# Altium schematic sheet RXTX4F1.SchDoc
size A
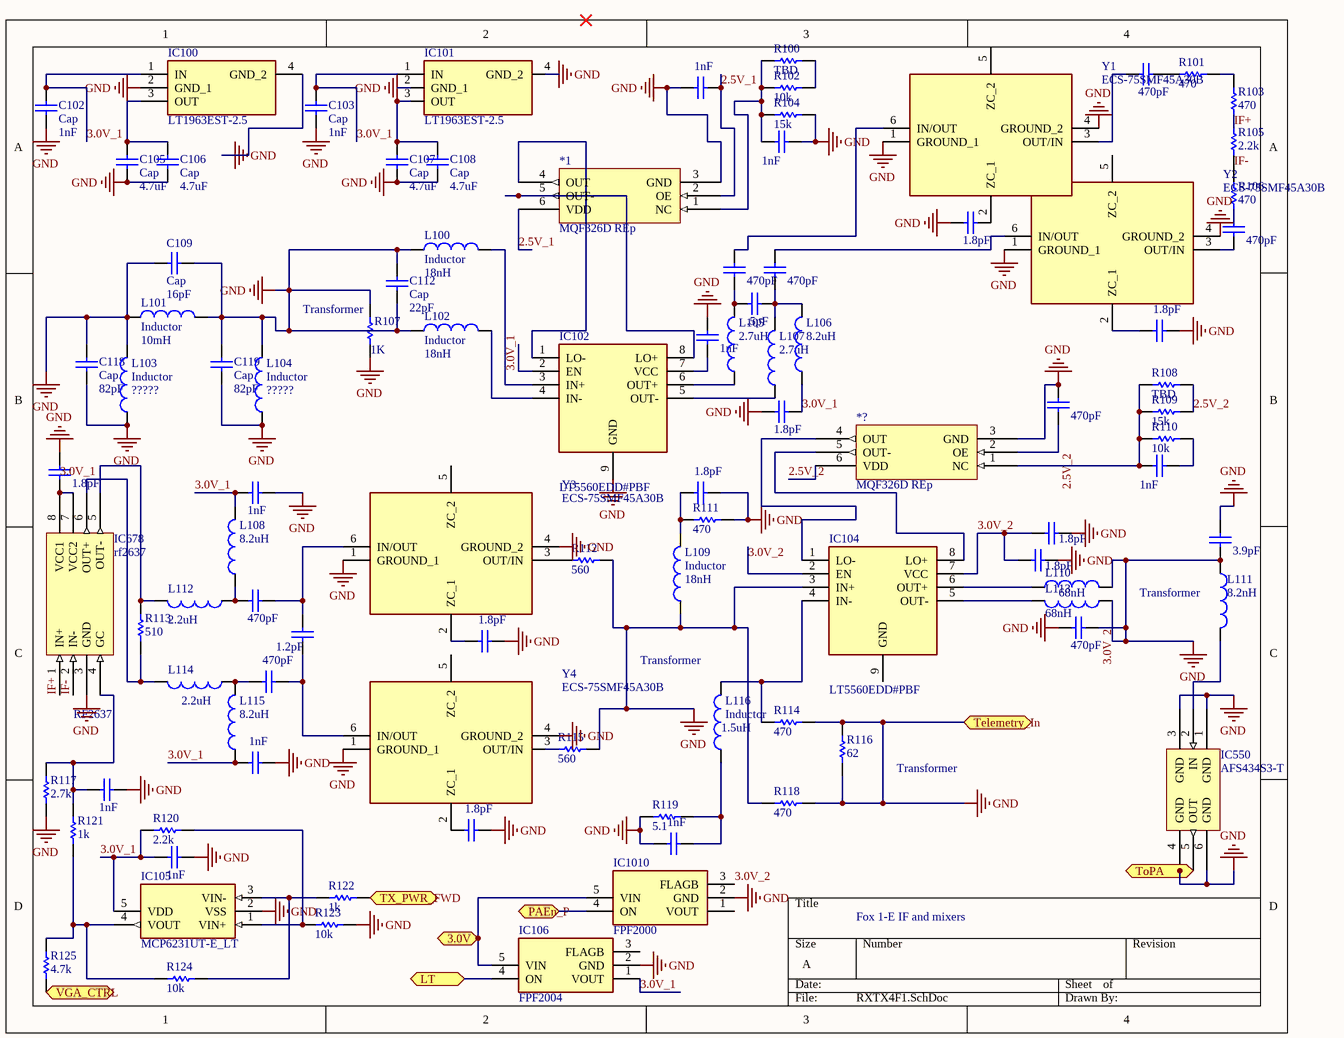
[diagram p0: RXTX4F1.SchDoc]

## Parts
*1  MQF326D REp  [MQF326D]
*?  MQF326D REp  [MQF326D]
C100  value 470pF  [0603]  (hidden comment: Cap)
C101  value 1nF  [0603]  (hidden comment: Cap)
C102  Cap  value 1nF  [0603]
C103  Cap  value 1nF  [0603]
C104  value 1nF  [0603]  (hidden comment: Cap)
C105  Cap  value 4.7uF  [0603]
C106  Cap  value 4.7uF  [0603]
C107  Cap  value 4.7uF  [0603]
C108  Cap  value 4.7uF  [0603]
C109  Cap  value 16pF  [0603]
C110  value 1.8pF  [0603]  (hidden comment: Cap)
C111  value 470pF  [0603]  (hidden comment: Cap)
C112  Cap  value 22pF  [0603]
C113  value 470pF  [0603]  (hidden comment: Cap)
C114  value 470pF  [0603]  (hidden comment: Cap)
C115  value 470pF  [0603]  (hidden comment: Cap)
C116  value .5pF  [0603]  (hidden comment: Cap)
C117  value 1.8pF  [0603]  (hidden comment: Cap)
C118  Cap  value 82pF  [0603]
C119  Cap  value 82pF  [0603]
C120  value 1nF  [0603]  (hidden comment: Cap)
C121  value 1nF  [0603]  (hidden comment: Cap)
C122  value 1.8pF  [0603]  (hidden comment: Cap)
C123  value 1.8pF  [0603]  (hidden comment: Cap)
C124  value 1.8pF  [0603]  (hidden comment: Cap)
C125  value 1nF  [0603]  (hidden comment: Cap)
C126  value 1.8pF  [0603]  (hidden comment: Cap)
C127  value 3.9pF  [0603]  (hidden comment: Cap)
C128  value 1.8pF  [0603]  (hidden comment: Cap)
C129  value 470pF  [0603]  (hidden comment: Cap)
C130  value 1.2pF  [0603]  (hidden comment: Cap)
C131  value 470pF  [0603]  (hidden comment: Cap)
C132  value 1.8pF  [0603]  (hidden comment: Cap)
C133  value 470pF  [0603]  (hidden comment: Cap)
C134  value 1nF  [0603]  (hidden comment: Cap)
C135  value 1nF  [0603]  (hidden comment: Cap)
C136  value 1.8pF  [0603]  (hidden comment: Cap)
C137  value 1nF  [0603]  (hidden comment: Cap)
C138  value 1nF  [0603]  (hidden comment: Cap)
IC100  LT1963EST-2.5  [SOT230P700X180-4N]
IC101  LT1963EST-2.5  [SOT230P700X180-4N]
IC102  LT5560EDD#PBF  [SON50P300X300X80-9N-D]
IC104  LT5560EDD#PBF  [SON50P300X300X80-9N-D]
IC105  MCP6231UT-E_LT  [SOT65P210X110-5N]
IC106  FPF2004  [SOT65P210X110-5N]
IC550  AFS434S3-T  [AFS434S3]
IC678  rf2637  [RF2637]
IC1010  FPF2000  [SOT65P210X110-5N]
L100  Inductor  value 18nH  [0603]
L101  Inductor  value 10mH  [0603]
L102  Inductor  value 18nH  [0603]
L103  Inductor  value ?????  [0603]
L104  Inductor  value ?????  [0603]
L105  value 2.7uH  [0603]  (hidden comment: Inductor)
L106  value 8.2uH  [0603]  (hidden comment: Inductor)
L107  value 2.7uH  [0603]  (hidden comment: Inductor)
L108  value 8.2uH  [0603]  (hidden comment: Inductor)
L109  Inductor  value 18nH  [0603]
L110  value 68nH  [0603]  (hidden comment: Inductor)
L111  value 8.2nH  [0603]  (hidden comment: Inductor)
L112  value 2.2uH  [0603]  (hidden comment: Inductor)
L113  value 68nH  [0603]  (hidden comment: Inductor)
L114  value 2.2uH  [0603]  (hidden comment: Inductor)
L115  value 8.2uH  [0603]  (hidden comment: Inductor)
L116  Inductor  value 1.5uH  [0603]
R100  value TBD  [0603]  (hidden comment: Res1)
R101  value 470  [0603]  (hidden comment: Res1)
R102  value 10k  [0603]  (hidden comment: Res1)
R103  value 470  [0603]  (hidden comment: Res1)
R104  value 15k  [0603]  (hidden comment: Res1)
R105  value 2.2k  [0603]  (hidden comment: Res1)
R106  value 470  [0603]  (hidden comment: Res1)
R107  value 1K  [0603]  (hidden comment: Res1)
R108  value TBD  [0603]  (hidden comment: Res1)
R109  value 15k  [0603]  (hidden comment: Res1)
R110  value 10k  [0603]  (hidden comment: Res1)
R111  value 470  [0603]  (hidden comment: Res1)
R112  value 560  [0603]  (hidden comment: Res1)
R113  value 510  [0603]  (hidden comment: Res1)
R114  value 470  [0603]  (hidden comment: Res1)
R115  value 560  [0603]  (hidden comment: Res1)
R116  value 62  [0603]  (hidden comment: Res1)
R117  value 2.7k  [0603]  (hidden comment: Res1)
R118  value 470  [0603]  (hidden comment: Res1)
R119  value 5.1  [0603]  (hidden comment: Res1)
R120  value 2.2k  [0603]  (hidden comment: Res1)
R121  value 1k  [0603]  (hidden comment: Res1)
R122  value 1k  [0603]  (hidden comment: Res1)
R123  value 10k  [0603]  (hidden comment: Res1)
R124  value 10k  [0603]  (hidden comment: Res1)
R125  value 4.7k  [0603]  (hidden comment: Res1)
Y1  ECS-75SMF45A30B  [ECS75SMF45A30B]
Y2  ECS-75SMF45A30B  [ECS75SMF45A30B]
Y3  ECS-75SMF45A30B  [ECS75SMF45A30B]
Y4  ECS-75SMF45A30B  [ECS75SMF45A30B]

## Ports
3.0V (bidir), LT (bidir), PAEn_P (bidir), Telemetry_In (bidir), ToPA (bidir), TX_PWR_FWD (bidir), VGA_CTRL (bidir)

## Nets
3.0V_2: *1.3(GND) *?.3(GND) C101.2 C102.1 C103.1 C104.1 C105.1 C106.1 C107.1 C108.1 C109.1 C109.2 C110.1 C112.1 C112.2 C113.1 C117.1 C118.1 C118.2 C119.1 C119.2 C120.1 C122.1 C123.1 C124.1 C125.1 C126.1 C126.2 C127.1 C127.2 C128.1 C128.2 C131.1 C131.2 C132.1 C134.1 C135.2 C136.1 C137.2 C138.2 IC100.2(GND_1) IC100.4(GND_2) IC101.2(GND_1) IC101.4(GND_2) IC102.9(GND) IC104.2(EN) IC104.3(IN+) IC104.7(VCC) IC105.2(VSS) IC106.2(GND) IC550.1(GND) IC550.3(GND) IC550.4(GND) IC550.6(GND) IC678.3(GND) IC1010.2(GND) IC1010.3(FLAGB) L100.1 L101.1 L101.2 L102.1 L103.1 L103.2 L104.1 L104.2 L109.1 L110.2 L111.1 L113.1 R104.1 R107.1 R107.2 R111.1 R112.1 R114.1 R115.1 R116.1 R116.2 R117.2 R118.1 R118.2 R119.2 R123.2 Y1.1(GROUND_1) Y1.4(GROUND_2) Y2.1(GROUND_1) Y2.4(GROUND_2) Y3.1(GROUND_1) Y3.4(GROUND_2) Y4.1(GROUND_1) Y4.4(GROUND_2) ; port Telemetry_In  [also labelled GND]
2.5V_1: *1.2(OE) *1.6(VDD) C101.1
2.5V_2: *?.2(OE) *?.6(VDD) C113.2 R108.1 R109.1
3.0V: IC106.5(VIN) IC1010.5(VIN) ; port 3.0V
3.0V_1: C102.2 C103.2 C122.2 C125.2 C134.2 C138.1 IC100.1(IN) IC101.1(IN) IC102.2(EN) IC105.5(VDD) IC106.1(VOUT) L106.1 L108.2 L115.1 R120.1
IF+: IC678.1(IN+) R103.2 R105.1
IF-: IC678.2(IN-) R105.2 R106.1
LT: IC106.4(ON) ; port LT
PAEn_P: IC1010.4(ON) ; port PAEn_P
ToPA: IC550.5(OUT) ; port ToPA
TX_PWR_FWD: R122.2 ; port TX_PWR_FWD
VGA_CTRL: R125.2 ; port VGA_CTRL
Net*1_1: *1.1(NC) C104.2 R100.2 R102.2 R104.2
Net*1_4: *1.4(OUT) IC102.1(LO-)
Net*1_5: *1.5(OUT-) IC102.8(LO+)
Net*?_1: *?.1(NC) C121.2 R108.2 R109.2 R110.2
Net*?_4: *?.4(OUT) IC104.1(LO-)
Net*?_5: *?.5(OUT-) IC104.8(LO+)
NetC100_1: C100.1 R101.2
NetC100_2: C100.2 Y1.3(OUT/IN)
NetC105_2: C105.2 C106.2 IC100.3(OUT)
NetC107_2: C107.2 C108.2 IC101.3(OUT)
NetC110_2: C110.2 Y1.2(ZC_1)
NetC111_1: C111.1 Y2.3(OUT/IN)
NetC111_2: C111.2 R106.2
NetC114_1: C114.1 C116.2 L105.2
NetC114_2: C114.2 Y1.6(IN/OUT)
NetC115_1: C115.1 C116.1 L106.2 L107.2
NetC115_2: C115.2 Y2.6(IN/OUT)
NetC117_2: C117.2 Y2.2(ZC_1)
NetC120_2: C120.2 IC102.7(VCC)
NetC121_1: C121.1 R110.1
NetC123_2: C123.2 L109.2 R111.2
NetC124_2: C124.2 IC678.7(VCC2) IC678.8(VCC1)
NetC129_1: C129.1 C130.1 Y3.6(IN/OUT)
NetC129_2: C129.2 L108.1 L112.1
NetC130_2: C130.2 C133.1 Y4.6(IN/OUT)
NetC132_2: C132.2 Y3.2(ZC_1)
NetC133_2: C133.2 L114.1 L115.2
NetC135_1: C135.1 IC678.4(GC) R117.1 R121.1
NetC136_2: C136.2 Y4.2(ZC_1)
NetC137_1: C137.1 L116.1 R119.1
NetIC102_3: IC102.3(IN+) L100.2
NetIC102_4: IC102.4(IN-) L102.2
NetIC102_5: IC102.5(OUT-) L107.1
NetIC102_6: IC102.6(OUT+) L105.1
NetIC104_4: IC104.4(IN-) L116.2 R114.2
NetIC104_5: IC104.5(OUT-) L113.2
NetIC104_6: IC104.6(OUT+) L110.1
NetIC105_1: IC105.1(VIN+) R120.2 R123.1
NetIC105_3: IC105.3(VIN-) R122.1 R124.2
NetIC105_4: IC105.4(VOUT) R121.2 R124.1 R125.1
NetIC550_2: IC550.2(IN) L111.2
NetIC678_5: IC678.5(OUT-) L112.2 R113.1
NetIC678_6: IC678.6(OUT+) L114.2 R113.2
NetR100_1: R100.1 R102.1
NetR101_1: R101.1 R103.1
NetR112_2: R112.2 Y3.3(OUT/IN)
NetR115_2: R115.2 Y4.3(OUT/IN)

Not connected (* = marked no-connect by the designer): IC104 9(GND); IC106 3(FLAGB); IC1010 1(VOUT); Y1 5(ZC_2); Y2 5(ZC_2); Y3 5(ZC_2); Y4 5(ZC_2)

## Notes on the sheet
- (near R107) Transformer
- (near L111) Transformer
- RF2637
- (near L116) Transformer
- Transformer
- Fox 1-E IF and mixers
- Labels drawn without touching a wire or pin: 3.0V_1

## Library data of the parts
*1 *? IC550 IC678 = Component_1
C100-C138 = Cap: Capacitor; Published: 8-Jun-2000; LatestRevisionDate: 17-Jul-2002; LatestRevisionNote: Re-released for DXP Platform.; PackageReference: RAD-0.3; Publisher: Altium Limited; PackageDescription: Radial Cap, Thru-Hole; 2 Leads; 0.3 in Pin Spacing
IC100 IC101 = LT1963EST-2.5: Integrated Circuit; Manufacturer_Name: Linear Technology; Datasheet Link: https://www.mouser.com/datasheet/2/609/1963fc-1270290.pdf; Height: 1.8mm; Manufacturer_Part_Number: LT1963EST-2.5; Mouser Part Number: 584-LT1963EST-2.5; Mouser Price/Stock: https://www.mouser.com/Search/Refine.aspx?Keyword=584-LT1963EST-2.5
IC102 IC104 = LT5560EDD#PBF: Integrated Circuit; Manufacturer_Name: Linear Technology; Datasheet Link: https://www.analog.com/media/en/technical-documentation/data-sheets/5560f.pdf; Height: 0.8mm; Manufacturer_Part_Number: LT5560EDD#PBF; Mouser Part Number: 584-LT5560EDD#PBF; Mouser Price/Stock: https://www.mouser.com/Search/Refine.aspx?Keyword=584-LT5560EDD%23PBF; RS Part Number: 7869705; RS Price/Stock: https://uk.rs-online.com/web/p/products/7869705
IC105 = MCP6231UT-E_LT: Integrated Circuit; Manufacturer_Name: Microchip; Manufacturer_Part_Number: MCP6231UT-E/LT; Allied_Number: 70414866; Datasheet Link: http://ww1.microchip.com/downloads/en/DeviceDoc/21881e.pdf; Height: 1.1mm; Mouser Part Number: 579-MCP6231UT-E/LT; Mouser Price/Stock: https://www.mouser.com/Search/Refine.aspx?Keyword=579-MCP6231UT-E%2FLT; RS Part Number: 7240643P; RS Price/Stock: http://uk.rs-online.com/web/p/products/7240643P; Allied Price/Stock: http://www.alliedelec.com/microchip-technology-inc-mcp6231ut-e-lt/70414866/
IC106 = FPF2004: Integrated Circuit; Manufacturer_Name: ON Semiconductor; Datasheet Link: https://www.onsemi.com/pub/Collateral/FPF2001-D.pdf; Height: 1.1mm; Manufacturer_Part_Number: FPF2004; Mouser Part Number: 512-FPF2004; Mouser Price/Stock: https://www.mouser.com/Search/Refine.aspx?Keyword=512-FPF2004; RS Part Number: 8088916P; RS Price/Stock: http://uk.rs-online.com/web/p/products/8088916P
IC1010 = FPF2000: Integrated Circuit; Manufacturer_Name: ON Semiconductor; Datasheet Link: https://www.onsemi.com/pub/Collateral/FPF2001-D.pdf; Height: 1.1mm; Manufacturer_Part_Number: FPF2000; Mouser Part Number: 512-FPF2000; Mouser Price/Stock: https://www.mouser.com/Search/Refine.aspx?Keyword=512-FPF2000; RS Part Number: 6709942P; RS Price/Stock: http://uk.rs-online.com/web/p/products/6709942P
L100-L116 = Inductor: Code_IEC: 1005; Published: 8-Jun-2000; LatestRevisionDate: 29-May-2009; LatestRevisionNote: IPC-7351 Footprint Added.; PackageReference: 0402-A; Publisher: Altium Limited; PackageDescription: Chip Inductor; Code_JEITA: 0402
R100-R125 = Res1: Resistor; Published: 8-Jun-2000; LatestRevisionDate: 17-Jul-2002; LatestRevisionNote: Re-released for DXP Platform.; PackageReference: AXIAL-0.3; Publisher: Altium Limited; PackageDescription: Axial Device, Thru-Hole; 2 Leads; 0.3 in Pin Spacing
Y1-Y4 = ECS-75SMF45A30B: Crystal or Oscillator; Manufacturer_Name: ECS; Datasheet Link: https://www.mouser.com/datasheet/2/122/ECS_75SMF-10007.pdf; Height: 0.95mm; Manufacturer_Part_Number: ECS-75SMF45A30B; Mouser Part Number: 520-ECS-75SMF45A30B; Mouser Price/Stock: https://www.mouser.com/Search/Refine.aspx?Keyword=520-ECS-75SMF45A30B